# Altium schematic sheet ADC-ADC.SchDoc: <SPECIFIC SHEET FUNCTION>
size A3; Date: DO NOT USE, RATHER USE PROJ OPTIONS; DrawnBy: DO NOT USE, RATHER USE PROJ OPTIONS; Engineer: DO NOT USE, RATHER USE PROJ OPTIONS; Organization: DO NOT USE, RATHER USE PROJ OPTIONS; DocumentNumber: 10; Revision: DO NOT USE, RATHER USE PROJ OPTIONS; SheetNumber: 5; SheetTotal: 12; SCH_Sheet_Filename: ADC-ADC.SchDoc; CurrentTime: DO NOT USE, RATHER USE PROJ OPTIONS; Time: DO NOT USE, RATHER USE PROJ OPTIONS; DocumentFullPathAndName: DO NOT USE, RATHER USE PROJ OPTIONS; DocumentName: DO NOT USE, RATHER USE PROJ OPTIONS; ModifiedDate: DO NOT USE, RATHER USE PROJ OPTIONS; ImagePath: DO NOT USE, RATHER USE PROJ OPTIONS
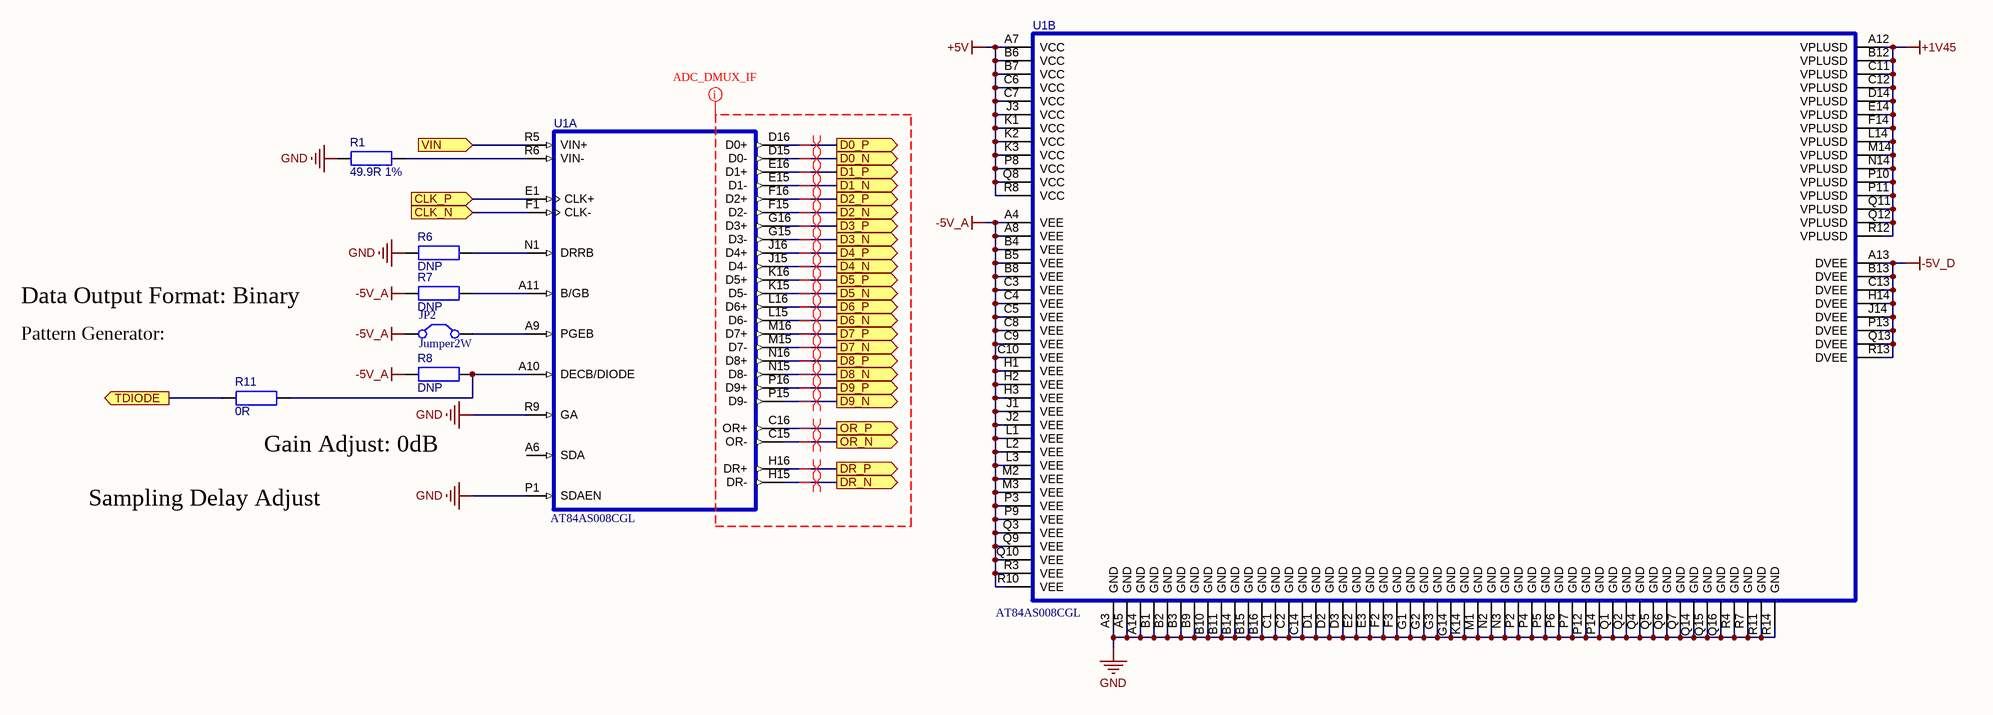
[diagram p0: ADC-ADC.SchDoc]

## Parts
JP2  Jumper2W  [JP-100MIL]
R1  49.9R 1%  [0603]
R6  DNP  [0603]
R7  DNP  [0603]
R8  DNP  [0603]
R11  0R  [0603]
U1  AT84AS008CGL  [BGA156x16]  (parts A,B of 2)

## Ports
CLK_N (in), CLK_P (in), D0_N (out), D0_P (out), D1_N (out), D1_P (out), D2_N (out), D2_P (out), D3_N (out), D3_P (out), D4_N (out), D4_P (out), D5_N (out), D5_P (out), D6_N (out), D6_P (out), D7_N (out), D7_P (out), D8_N (out), D8_P (out), D9_N (out), D9_P (out), DR_N (out), DR_P (out), OR_N (out), OR_P (out), TDIODE (out), VIN (in)

## Nets
+1V45: U1.A12(VPLUSD) U1.B12(VPLUSD) U1.C11(VPLUSD) U1.C12(VPLUSD) U1.D14(VPLUSD) U1.E14(VPLUSD) U1.F14(VPLUSD) U1.L14(VPLUSD) U1.M14(VPLUSD) U1.N14(VPLUSD) U1.P10(VPLUSD) U1.P11(VPLUSD) U1.Q11(VPLUSD) U1.Q12(VPLUSD) U1.R12(VPLUSD)
+5V: U1.A7(VCC) U1.B6(VCC) U1.B7(VCC) U1.C6(VCC) U1.C7(VCC) U1.J3(VCC) U1.K1(VCC) U1.K2(VCC) U1.K3(VCC) U1.P8(VCC) U1.Q8(VCC) U1.R8(VCC)
-5V_A: JP2.1(C1) R7.1 R8.1 U1.A4(VEE) U1.A8(VEE) U1.B4(VEE) U1.B5(VEE) U1.B8(VEE) U1.C3(VEE) U1.C4(VEE) U1.C5(VEE) U1.C8(VEE) U1.C9(VEE) U1.C10(VEE) U1.H1(VEE) U1.H2(VEE) U1.H3(VEE) U1.J1(VEE) U1.J2(VEE) U1.L1(VEE) U1.L2(VEE) U1.L3(VEE) U1.M2(VEE) U1.M3(VEE) U1.P3(VEE) U1.P9(VEE) U1.Q3(VEE) U1.Q9(VEE) U1.Q10(VEE) U1.R3(VEE) U1.R10(VEE)
-5V_D: U1.A13(DVEE) U1.B13(DVEE) U1.C13(DVEE) U1.H14(DVEE) U1.J14(DVEE) U1.P13(DVEE) U1.Q13(DVEE) U1.R13(DVEE)
GND: R1.1 R6.1 U1.A3(GND) U1.A5(GND) U1.A14(GND) U1.B1(GND) U1.B2(GND) U1.B3(GND) U1.B9(GND) U1.B10(GND) U1.B11(GND) U1.B14(GND) U1.B15(GND) U1.B16(GND) U1.C1(GND) U1.C2(GND) U1.C14(GND) U1.D1(GND) U1.D2(GND) U1.D3(GND) U1.E2(GND) U1.E3(GND) U1.F2(GND) U1.F3(GND) U1.G1(GND) U1.G2(GND) U1.G3(GND) U1.G14(GND) U1.K14(GND) U1.M1(GND) U1.N2(GND) U1.N3(GND) U1.P1(SDAEN) U1.P2(GND) U1.P4(GND) U1.P5(GND) U1.P6(GND) U1.P7(GND) U1.P12(GND) U1.P14(GND) U1.Q1(GND) U1.Q2(GND) U1.Q4(GND) U1.Q5(GND) U1.Q6(GND) U1.Q7(GND) U1.Q14(GND) U1.Q15(GND) U1.Q16(GND) U1.R4(GND) U1.R7(GND) U1.R9(GA) U1.R11(GND) U1.R14(GND)
CLK_N: U1.F1(CLK-) ; port CLK_N
CLK_P: U1.E1(CLK+) ; port CLK_P
D0_N: U1.D15(D0-) ; port D0_N
D0_P: U1.D16(D0+) ; port D0_P
D1_N: U1.E15(D1-) ; port D1_N
D1_P: U1.E16(D1+) ; port D1_P
D2_N: U1.F15(D2-) ; port D2_N
D2_P: U1.F16(D2+) ; port D2_P
D3_N: U1.G15(D3-) ; port D3_N
D3_P: U1.G16(D3+) ; port D3_P
D4_N: U1.J15(D4-) ; port D4_N
D4_P: U1.J16(D4+) ; port D4_P
D5_N: U1.K15(D5-) ; port D5_N
D5_P: U1.K16(D5+) ; port D5_P
D6_N: U1.L15(D6-) ; port D6_N
D6_P: U1.L16(D6+) ; port D6_P
D7_N: U1.M15(D7-) ; port D7_N
D7_P: U1.M16(D7+) ; port D7_P
D8_N: U1.N15(D8-) ; port D8_N
D8_P: U1.N16(D8+) ; port D8_P
D9_N: U1.P15(D9-) ; port D9_N
D9_P: U1.P16(D9+) ; port D9_P
DR_N: U1.H15(DR-) ; port DR_N
DR_P: U1.H16(DR+) ; port DR_P
OR_N: U1.C15(OR-) ; port OR_N
OR_P: U1.C16(OR+) ; port OR_P
TDIODE: R11.1 ; port TDIODE
VIN: U1.R5(VIN+) ; port VIN
NetJP2_2: JP2.2(C2) U1.A9(PGEB)
NetR1_2: R1.2 U1.R6(VIN-)
NetR6_2: R6.2 U1.N1(DRRB)
NetR7_2: R7.2 U1.A11(B/GB)
NetR8_2: R8.2 R11.2 U1.A10(DECB/DIODE)

Not connected (* = marked no-connect by the designer): U1 A6(SDA)

## Layout directives
differential pair: D0_N, D0_P, D1_N, D1_P, D2_N, D2_P, D3_N, D3_P, D4_N, D4_P, D5_N, D5_P, D6_N, D6_P, D7_N, D7_P, D8_N, D8_P, D9_N, D9_P, DR_N, DR_P, OR_N, OR_P
net class ADC_DMUX_IF: (no net found under the mark)

## Notes on the sheet
- Data Output Format: Binary
- (near R11) Pattern Generator:
  Open - Disabled / Closed - Checker Board
- (near R11) Gain Adjust: 0dB
- Sampling Delay Adjust Disabled
- 2009   THIS DOCUMENT IS THE PROPERTY OF THE OWNER, AND MAY NOT BE COPIED OR USED FOR ANY PURPOSE OTHER THAN THAT FOR WHICH IT IS SUPPLIED WITHOUT PERMISSION IN WRITING FROM THE OWNER.
- C
- DATESTAMP OF THIS PRINT
- DRAWN BY:
- DOCUMENT NUMBER:
- SCHEMATIC FILENAME:
- PCB FILENAME:
- ENGINEER:
- APPROVED:
- CIRCUIT DIAGRAM
- DATE
- SHEET
- REVISION
- OF

## Library data of the parts
JP2 = Jumper2W: Jumper Wire; Published: 24-Mar-1999; LatestRevisionDate: 17-Jul-2002; LatestRevisionNote: Re-released for DXP Platform.; PackageReference: RAD-0.2; Publisher: Altium Limited
R1 = RES-0805: RESISTOR SMD 0805; Checked_By: NN; Manufacturer: *; Manufacturer_PN: *; Created_By: *; Checked_Date: 5-08-2009; HelpURL: *; ComponentLink1Description: Footprint Detail; ComponentLink1URL: *; ComponentLink2Description: Application Note; ComponentLink2URL: *; ComponentLink3Description: Layout Guidelines; ComponentLink3URL: *; ComponentLink4Description: Technology Reference; ComponentLink4URL: *; Supplier1: *; Supplier2: *; Unit_Cost: *; MOQ: *; Leadtime: *; Inventory_Stock: *; Tolerance: *; Wattage: *; Voltage: *; Package: 0805; ComponentLink5Description: Production Detail; ComponentLink5URL: *; Note: *; Stock Code: *; Value: 49.9R 1%
R6-R8 R11 = RES-0805: RESISTOR SMD 0603; Checked_By: NN; Manufacturer: *; Manufacturer_PN: *; Created_By: *; Checked_Date: 5-08-2009; HelpURL: *; ComponentLink1Description: Footprint Detail; ComponentLink1URL: *; ComponentLink2Description: Application Note; ComponentLink2URL: *; ComponentLink3Description: Layout Guidelines; ComponentLink3URL: *; ComponentLink4Description: Technology Reference; ComponentLink4URL: *; Supplier1: *; Supplier2: *; Unit_Cost: *; MOQ: *; Leadtime: *; Inventory_Stock: *; Tolerance: *; Wattage: *; Voltage: *; Package: 0603; ComponentLink5Description: Production Detail; ComponentLink5URL: *; Note: *; Stock Code: *
  R6-R8: Value: DNP
  R11: Value: 0R
U1 = AT84AS008CGL: 10-bit 2.2Gsps ADC; Manufacturer: e2V; Created_By: IN; Manufacturer_PN: AT84AS008CGL; Checked_By: *; Checked_Date: *; HelpURL: X:\Datasheets\By_Manufacturer\National Semi\ADC08D1520.pdf; ComponentLink1Description: X:\Datasheets\By_Manufacturer\National Semi\ADC08D1520.pdf#page=4; ComponentLink1URL: *; ComponentLink2Description: Application Note; ComponentLink2URL: *; ComponentLink3Description: Layout Guidelines; ComponentLink3URL: *; ComponentLink4Description: Technology Reference; ComponentLink4URL: *; Supplier1: *; Supplier2: *; Unit_Cost: *; MOQ: *; Leadtime: *; Inventory_Stock: *; Tolerance: *; Wattage: *; Voltage: *; Package: *; ComponentLink5Description: Production Detail; ComponentLink5URL: *; Note: *; Stock Code: *